# EasyEDA schematic Techligence_task1.json
TITLE: Sheet_1; REV: 1.0; Date: 2024-02-14; Sheet: 1/1; Company: Your Company
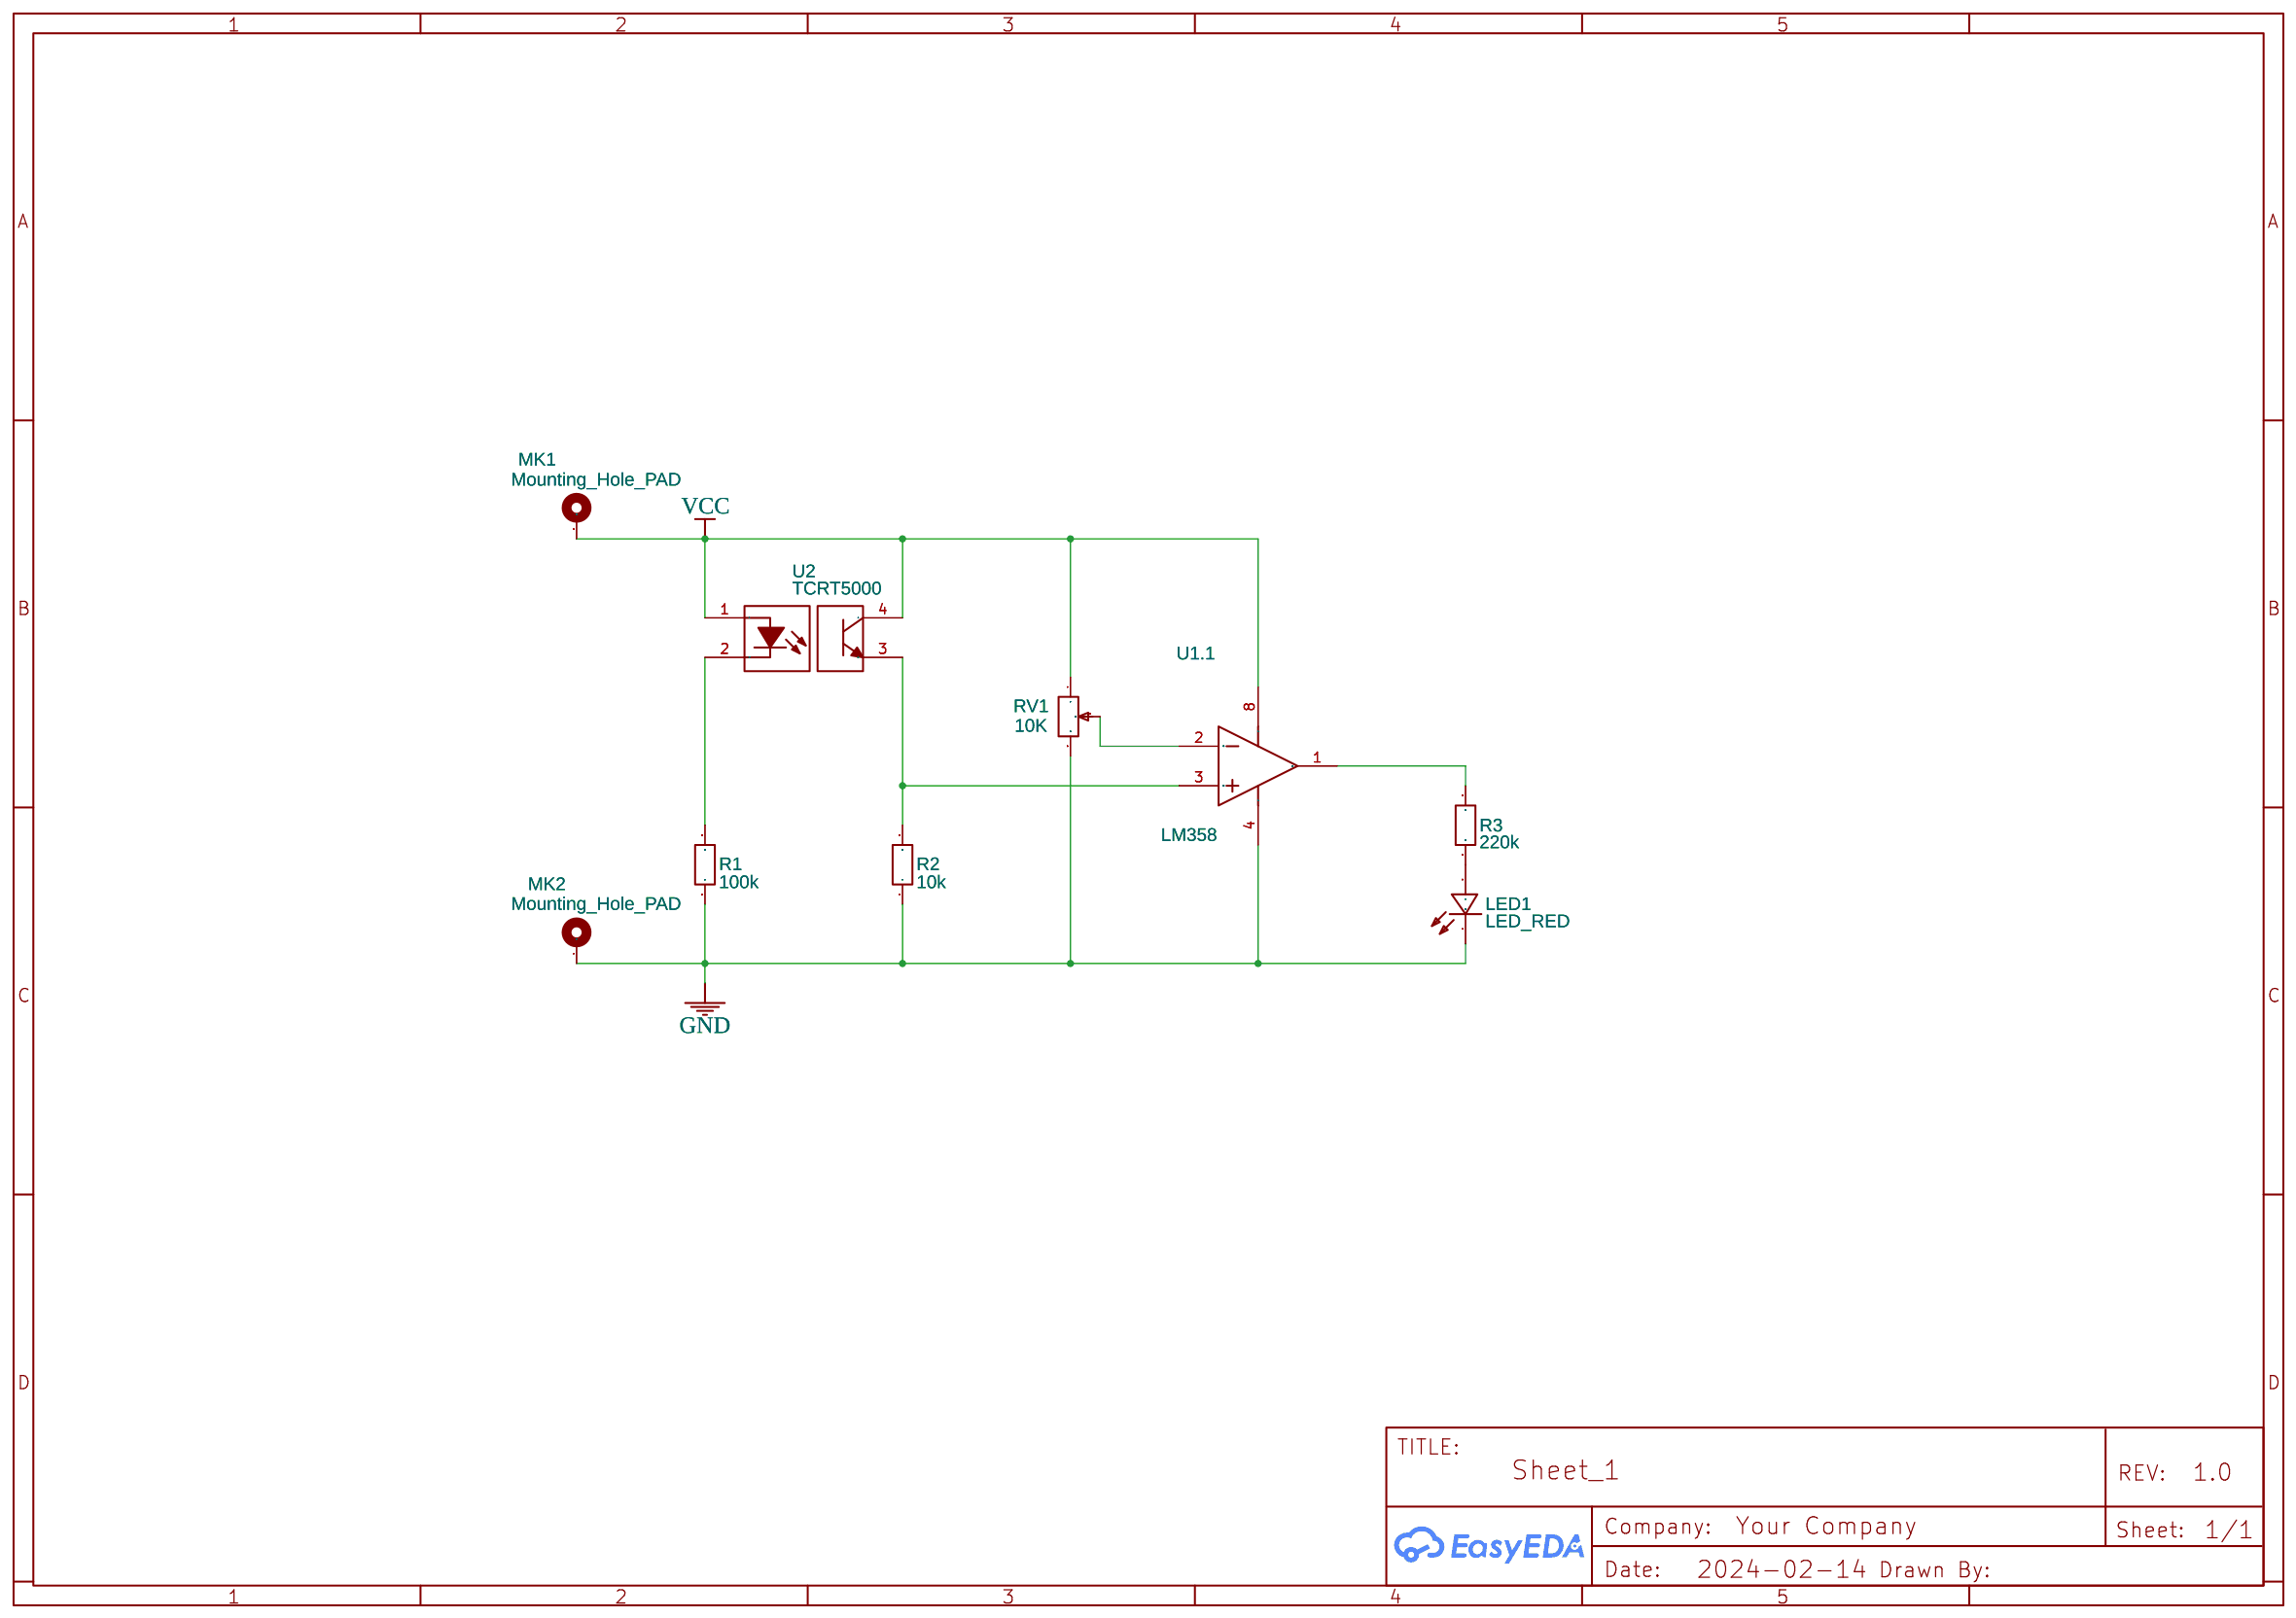
[diagram p0: schematic sheet]

## Parts
LED1  LED_RED  [LED0805-RD_RED]
MK1  Mounting_Hole_PAD  [PAD-THT-C050]
MK2  Mounting_Hole_PAD  [PAD-THT-C050]
R1  100k  [R0603]
R2  10k  [R0603]
R3  220k  [R0603]
RV1  10K  [RES-ADJ-SMD_VG039NCH]
U1  LM358  [TSSOP-8_L4.4-W3.0-P0.65-LS6.4-BL]  (section 1)
U2  TCRT5000  [OPTO-TH_TCRT5000]

## Library data of the parts
LED1 = SMDREDLED红色超高亮0805: Contributor: lcsc; Supplier: LCSC; Supplier Part: C9900019100; Manufacturer: null; Manufacturer Part: SMDRedLED红色超高亮0805; JLCPCB Part Class: Extended Part; Package Display: No
MK1 MK2 = Mounting_Hole_PAD: Contributor: KiCAD; license: https://www.gnu.org/licenses/lgpl-2.1.html
R1-R3 = R_0603_EU: Contributor: LCEDA_Lib; Package Display: No
RV1 = 3*3POTENTIOMETER-10KΩ20%: Contributor: LCSC; Supplier: LCSC; Supplier Part: C9900010776; Manufacturer: null; Manufacturer Part: 3*3Potentiometer-10kΩ20%; JLCPCB Part Class: Extended Part; Package Display: No
U1 = LM358LVIPWR: subpart_no: 1; Supplier: LCSC; Supplier Part: C2863217; Manufacturer: TI(德州仪器); JLCPCB Part Class: Extended Part
U2 = TCRT5000: Contributor: lcsc; Supplier: LCSC; Supplier Part: C2984661; Manufacturer: VISHAY(威世); JLCPCB Part Class: Extended Part

## Nets
GND: LED1.1(C) MK2.1 R1.1 R2.1 RV1.3 U1.4(V-)
VCC: MK1.1 RV1.1 U1.8(V+) U2.1 U2.4
Net-(LED1-2): LED1.2(A) R3.1
Net-(R1-2): R1.2 U2.2
Net-(R2-2): R2.2 U1.3(IN1+) U2.3
Net-(R3-2): R3.2 U1.1(OUT1)
Net-(RV1-2): RV1.2 U1.2(IN1-)
